# EAGLE design bicyclelab-charger-protection (EAGLE 6.2)
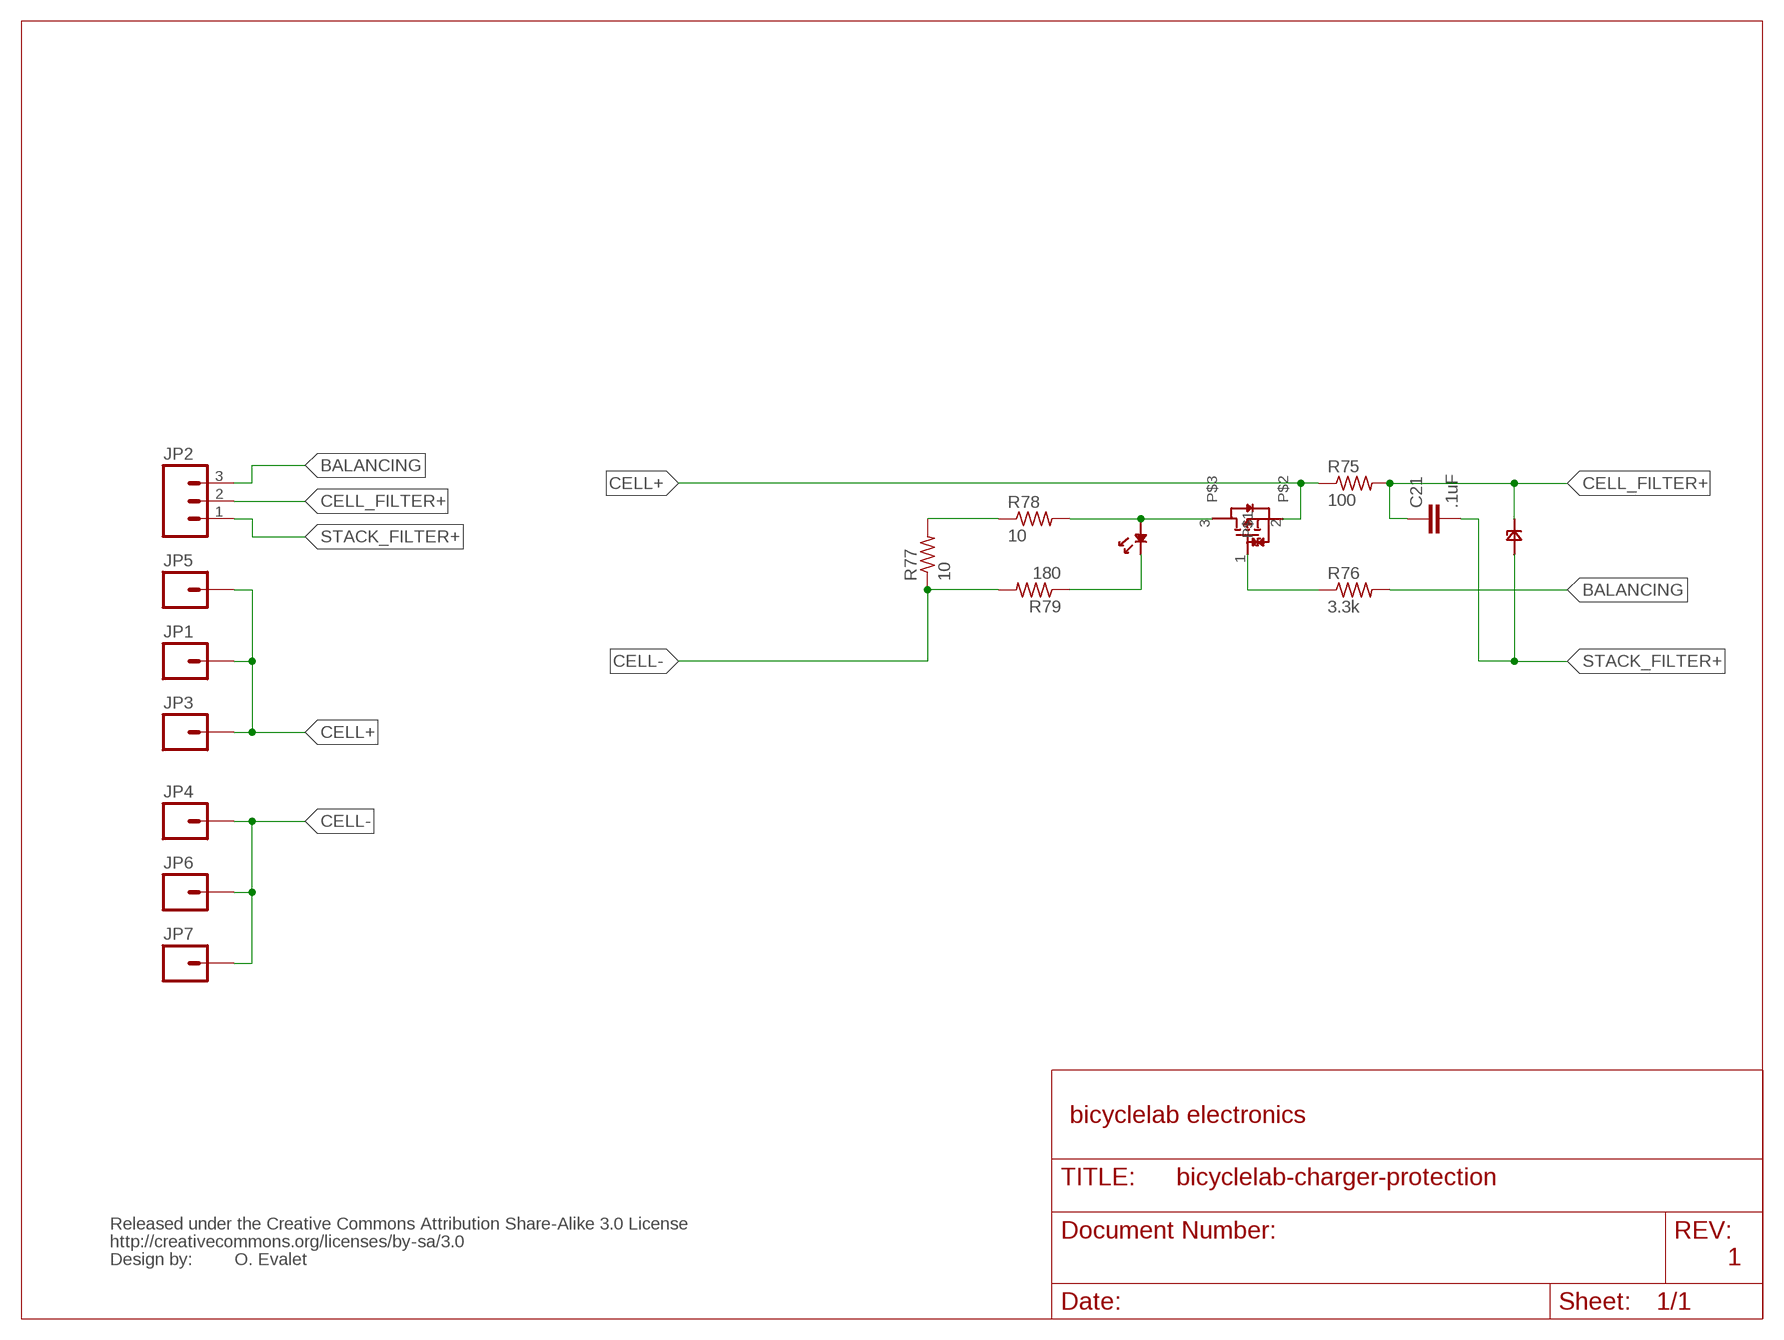
[diagram p0: schematic, sheet 1]

## Parts
C21  .1uF  C-EUC0402  [C0402]
JP1  M01SMD-4.5X1.5  [PAD-1.5X4.5]
JP2  M03PTH  [1X03]
JP3  M01SMD-4.5X1.5  [PAD-1.5X4.5]
JP4  M01SMD-4.5X1.5  [PAD-1.5X4.5]
JP5  M01SMD-4.5X1.5  [PAD-1.5X4.5]
JP6  M01SMD-4.5X1.5  [PAD-1.5X4.5]
JP7  M01SMD-4.5X1.5  [PAD-1.5X4.5]
LED12  LED-0805  [0805]
PD12  PDZ7.5B  [SOD323]
R75  100  R-US_R0402  [R0402]
R76  3.3k  R-US_R0402  [R0402]
R77  10  R-US_R2512  [R2512]
R78  10  R-US_R2512  [R2512]
R79  180  R-US_R0805  [R0805]
T12  RTR020P02  [TSMT3]
U$5  CREATIVE_COMMONS  [CREATIVE_COMMONS]

## Nets
BALANCING: JP2.3 R76.2
CELL+: JP1.P$1 JP3.P$1 JP5.P$1 R75.1 T12.2
CELL-: JP4.P$1 JP6.P$1 JP7.P$1 R77.1 R79.2
CELL_FILTER+: C21.1 JP2.2 PD12.P$1 R75.2
N$14: R77.2 R78.1
N$81: LED12.P$2 R78.2 T12.3
N$82: LED12.P$1 R79.1
N$83: R76.1 T12.1
STACK_FILTER+: C21.2 JP2.1 PD12.P$2

## Notes on the sheet
- bicyclelab electronics
- O. Evalet | 1

## Library data of the parts
C21 = rcl:C-EU: CAPACITOR, European symbol
JP1 JP3-JP7 = 0-SparkFun:M01: Header 1 Standard 1-pin 0.1" header. Use with straight break away headers (SKU : PRT-00116), right angle break away headers (PRT-00553), swiss pins (PRT-00743), machine pins (PRT-00117), and female headers (PRT-00115).
JP2 = 0-SparkFun:M03: Header 3 Standard 3-pin 0.1" header. Use with straight break away headers (SKU : PRT-00116), right angle break away headers (PRT-00553), swiss pins (PRT-00743), machine pins (PRT-00117), and female headers (PRT-00115). Molex polarized connector foot print use with SKU : PRT-08232 with associated crimp pins and housings.
LED12 = BMS:LED-0805: Green 2V 20mA SMT diode
PD12 = BMS:PDZ7.5B
R75-R79 = rcl:R-US_: RESISTOR, American symbol
T12 = BMS:RTR020P02
U$5 = SparkFun:CREATIVE_COMMONS

## Net classes
0 default: width 0.203 mm
1 power: width 0.508 mm

## Board
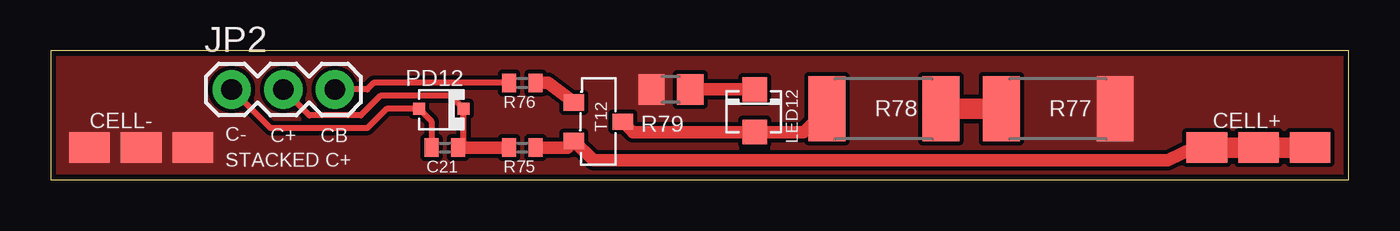
[diagram p1: board, top side]
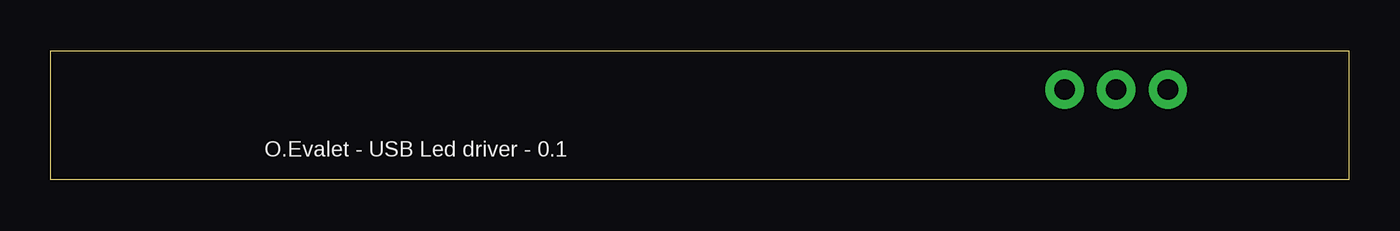
[diagram p2: board, bottom side, seen from below]

Size 63.8 x 6.34 mm. Coordinates in mm from the lower left corner, seen from the top.
Outline: 0,0 63.8,0 63.8,6.34 0,6.34 0,0
Copper layers (1*16): Top 0.035mm / dielectric 1.5mm / Bottom 0.035mm
Design rules: minimum track width 8mil, minimum drill 20mil, track to track 8mil, track to pad 8mil, pad to pad 8mil, via to via 8mil, smd to smd 8mil, copper to edge 10mil, drill to drill 8mil, minimum pad ring 12mil, minimum via ring 10mil, stop-mask expansion 4mil, vias tented up to drill 25mil, thermal gap 10mil

### Footprints (pad centres in the part's own frame; a part is rotated, then mirrored left to right if it is on the bottom)
C0402 = smd 0.7 x 0.9: 1 -0.65,0; 2 0.65,0
PAD-1.5X4.5 = smd 1.5 x 2: P$1 0,0
1X03 = drill 1.016 pad 1.88: 1 0,0; 2 2.54,0; 3 5.08,0
0805 = smd 1.2 x 1.2: P$1 0,0; P$2 2.1,0
SOD323 = smd 0.6 x 0.6: P$1 -2.2,0; P$2 0,0
R0402 = smd 0.7 x 0.9: 1 -0.65,0; 2 0.65,0
R2512 = smd 1.8 x 3.2: 1 -2.8,0; 2 2.8,0
R0805 = smd 1.3 x 1.5: 1 -0.95,0; 2 0.95,0
TSMT3 = smd 0.8 x 1: 1 -0.95,0; 2 0.95,0; 3 0,2.4

### Placement (x,y rotation side)
C21  19.37,1.59 180 top
JP1  59.37,1.59 90 top
JP2  8.89,4.45 0 top
JP3  56.83,1.59 90 top
JP4  1.91,1.59 90 top
JP5  61.91,1.59 90 top
JP6  4.45,1.59 90 top
JP7  6.99,1.59 90 top
LED12  34.61,4.45 270 top
PD12  18.1,3.49 180 top
R75  23.18,1.59 180 top
R76  23.18,4.76 180 top
R77  49.53,3.49 180 top
R78  40.96,3.49 180 top
R79  30.48,4.45 180 top
T12  25.72,2.86 270 top
U$5  3.49,-10.48 0 top  (outside the outline)

### Tracks (layer width: path | path; a pad name or v marks a point on that pad's centre or on a via)
BALANCING
  Top 0.305: R76.2 15.88,4.76 15.56,4.45 JP2.3
CELL+
  Top 0.61: R75.1 25.4,1.59 T12.2 26.67,0.95 54.93,0.95 56.2,1.59 JP3.P$1
  Top 1.016: JP3.P$1 JP1.P$1 JP5.P$1
CELL-
  pour Top (rank 4, no thermals): 0,6.35 63.82,6.35 63.82,0 0,0
CELL_FILTER+
  Top 0.305: C21.1 20.3,1.87 PD12.P$1 19.66,4.13 16.19,4.13 15.24,3.17 12.7,3.17 JP2.2
  Top 0.61: R75.2 C21.1
N$14
  Top 1.016: R78.1 R77.2
N$81
  Top 0.61: R78.2 37.01,2.35 LED12.P$2 28.63,2.35 T12.3
N$82
  Top 0.61: LED12.P$1 R79.1
N$83
  Top 0.61: T12.1 24.45,4.76 R76.1
STACK_FILTER+
  Top 0.305: C21.2 18.72,2.87 PD12.P$2 16.51,3.49 15.56,2.54 10.79,2.54 JP2.1

### Text on the board
tPlace: CELL- | C+ | CB | CELL+ | C- | STACKED C+
bPlace: O.Evalet - USB Led driver - 0.1
tValues: O.Evalet